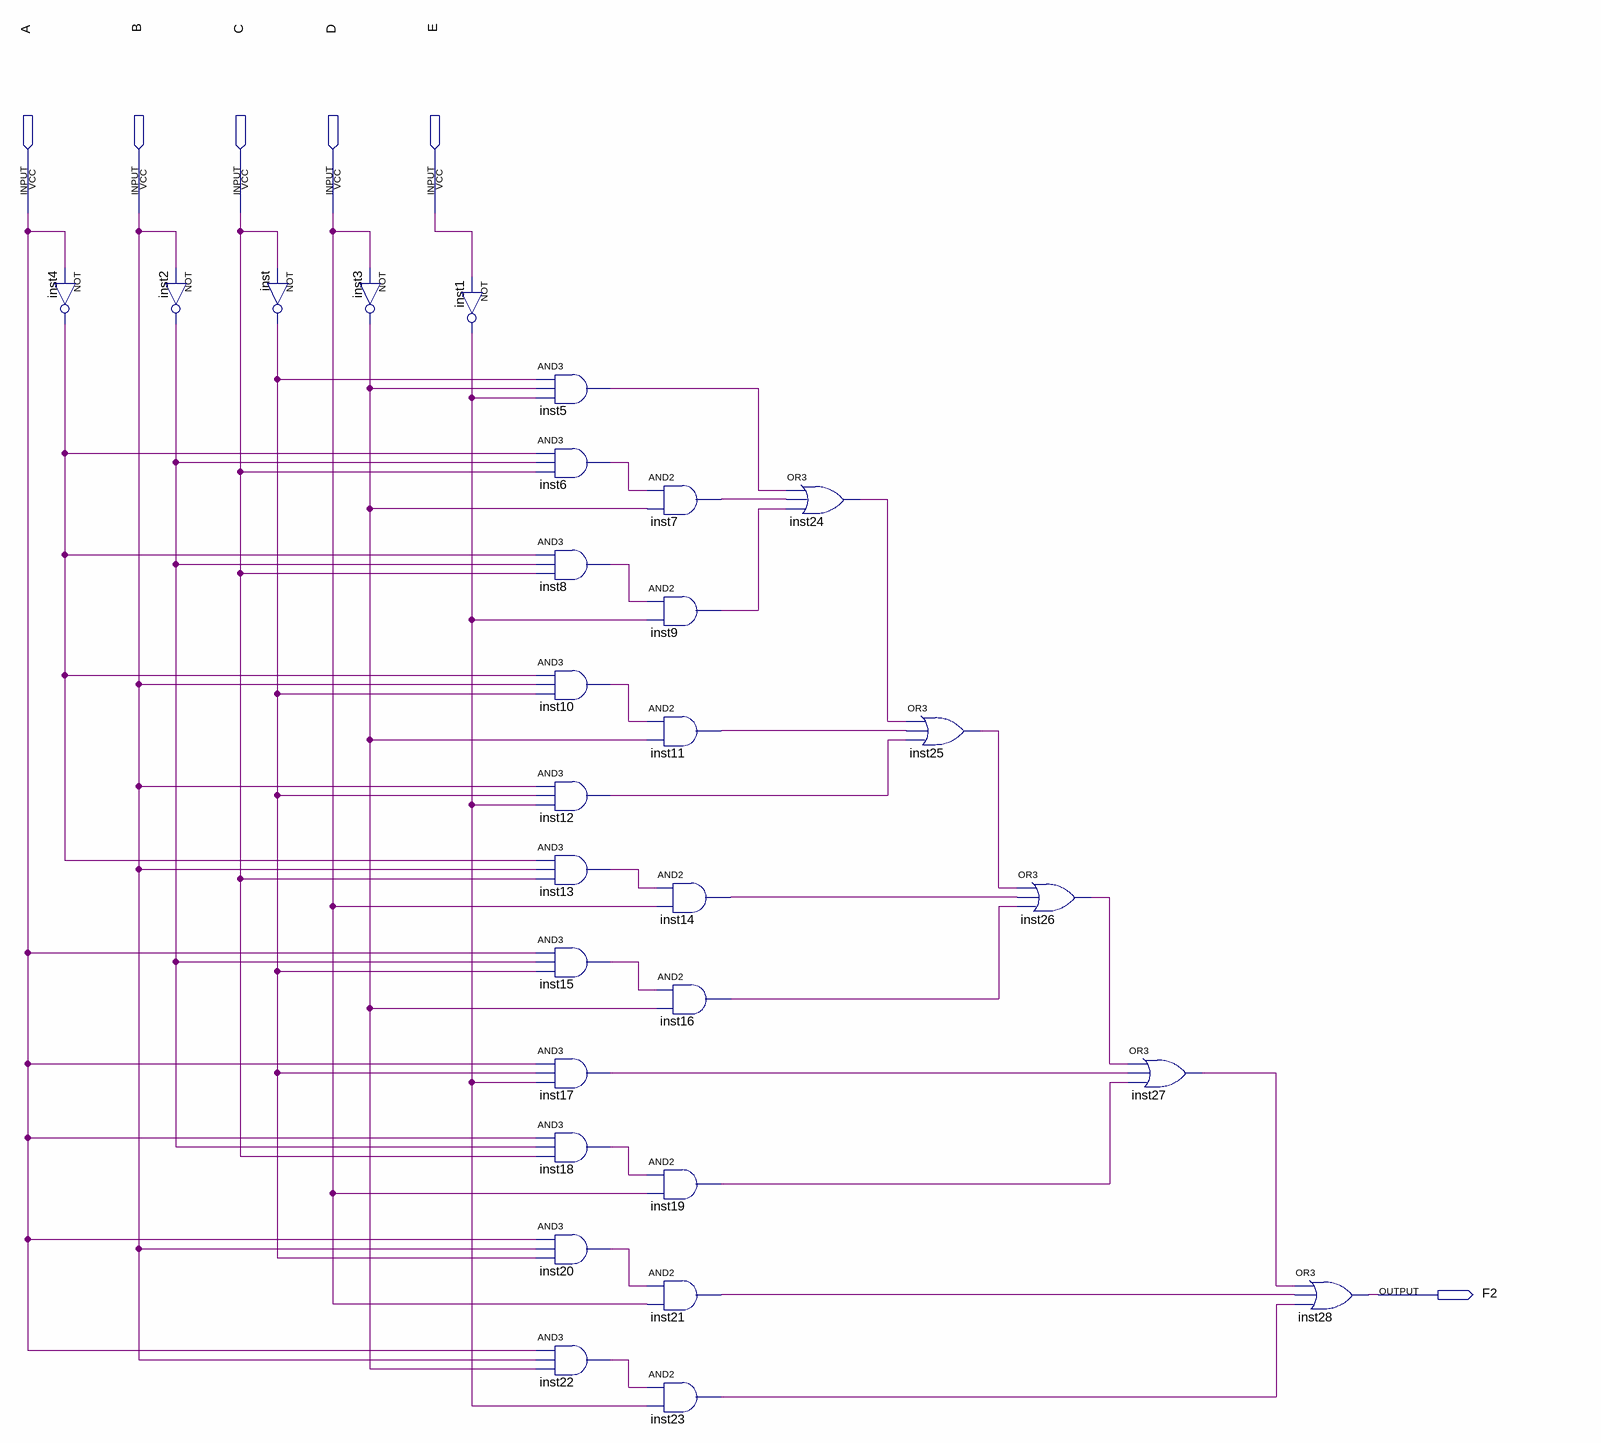
[diagram p0: schematic sheet]
// Quartus schematic led-F2.bdf as structural Verilog: 29 symbols, 6 pins
module \led-F2  (
  input  A,
  input  B,
  input  C,
  input  D,
  input  E,
  output F2
);

  wire inst1_out, inst2_out, inst3_out, inst4_out, inst5_out, inst6_out, inst7_out, inst8_out, inst9_out,
       inst10_out, inst11_out, inst12_out, inst13_out, inst14_out, inst15_out, inst16_out, inst17_out,
       inst18_out, inst19_out, inst20_out, inst21_out, inst22_out, inst23_out, inst24_out, inst25_out,
       inst26_out, inst27_out, inst_out;

  not inst4 (inst4_out, A);
  not inst2 (inst2_out, B);
  not inst (inst_out, C);
  not inst3 (inst3_out, D);
  not inst1 (inst1_out, E);
  and inst5 (inst5_out, inst_out, inst3_out, inst1_out);
  and inst6 (inst6_out, inst4_out, inst2_out, C);
  and inst8 (inst8_out, inst4_out, inst2_out, C);
  and inst10 (inst10_out, inst4_out, B, inst_out);
  and inst12 (inst12_out, B, inst_out, inst1_out);
  and inst13 (inst13_out, inst4_out, B, C);
  and inst15 (inst15_out, A, inst2_out, inst_out);
  and inst17 (inst17_out, A, inst_out, inst1_out);
  and inst18 (inst18_out, A, inst2_out, C);
  and inst20 (inst20_out, A, B, inst_out);
  and inst22 (inst22_out, A, B, inst3_out);
  and inst7 (inst7_out, inst6_out, inst3_out);
  and inst9 (inst9_out, inst8_out, inst1_out);
  and inst11 (inst11_out, inst10_out, inst3_out);
  and inst14 (inst14_out, inst13_out, D);
  and inst16 (inst16_out, inst15_out, inst3_out);
  and inst19 (inst19_out, inst18_out, D);
  and inst21 (inst21_out, inst20_out, D);
  and inst23 (inst23_out, inst22_out, inst1_out);
  or inst24 (inst24_out, inst5_out, inst7_out, inst9_out);
  or inst25 (inst25_out, inst24_out, inst11_out, inst12_out);
  or inst26 (inst26_out, inst25_out, inst14_out, inst16_out);
  or inst27 (inst27_out, inst26_out, inst17_out, inst19_out);
  or inst28 (F2, inst27_out, inst21_out, inst23_out);
endmodule
